# EAGLE board SOTB_LWC (EAGLE 9.6.2)
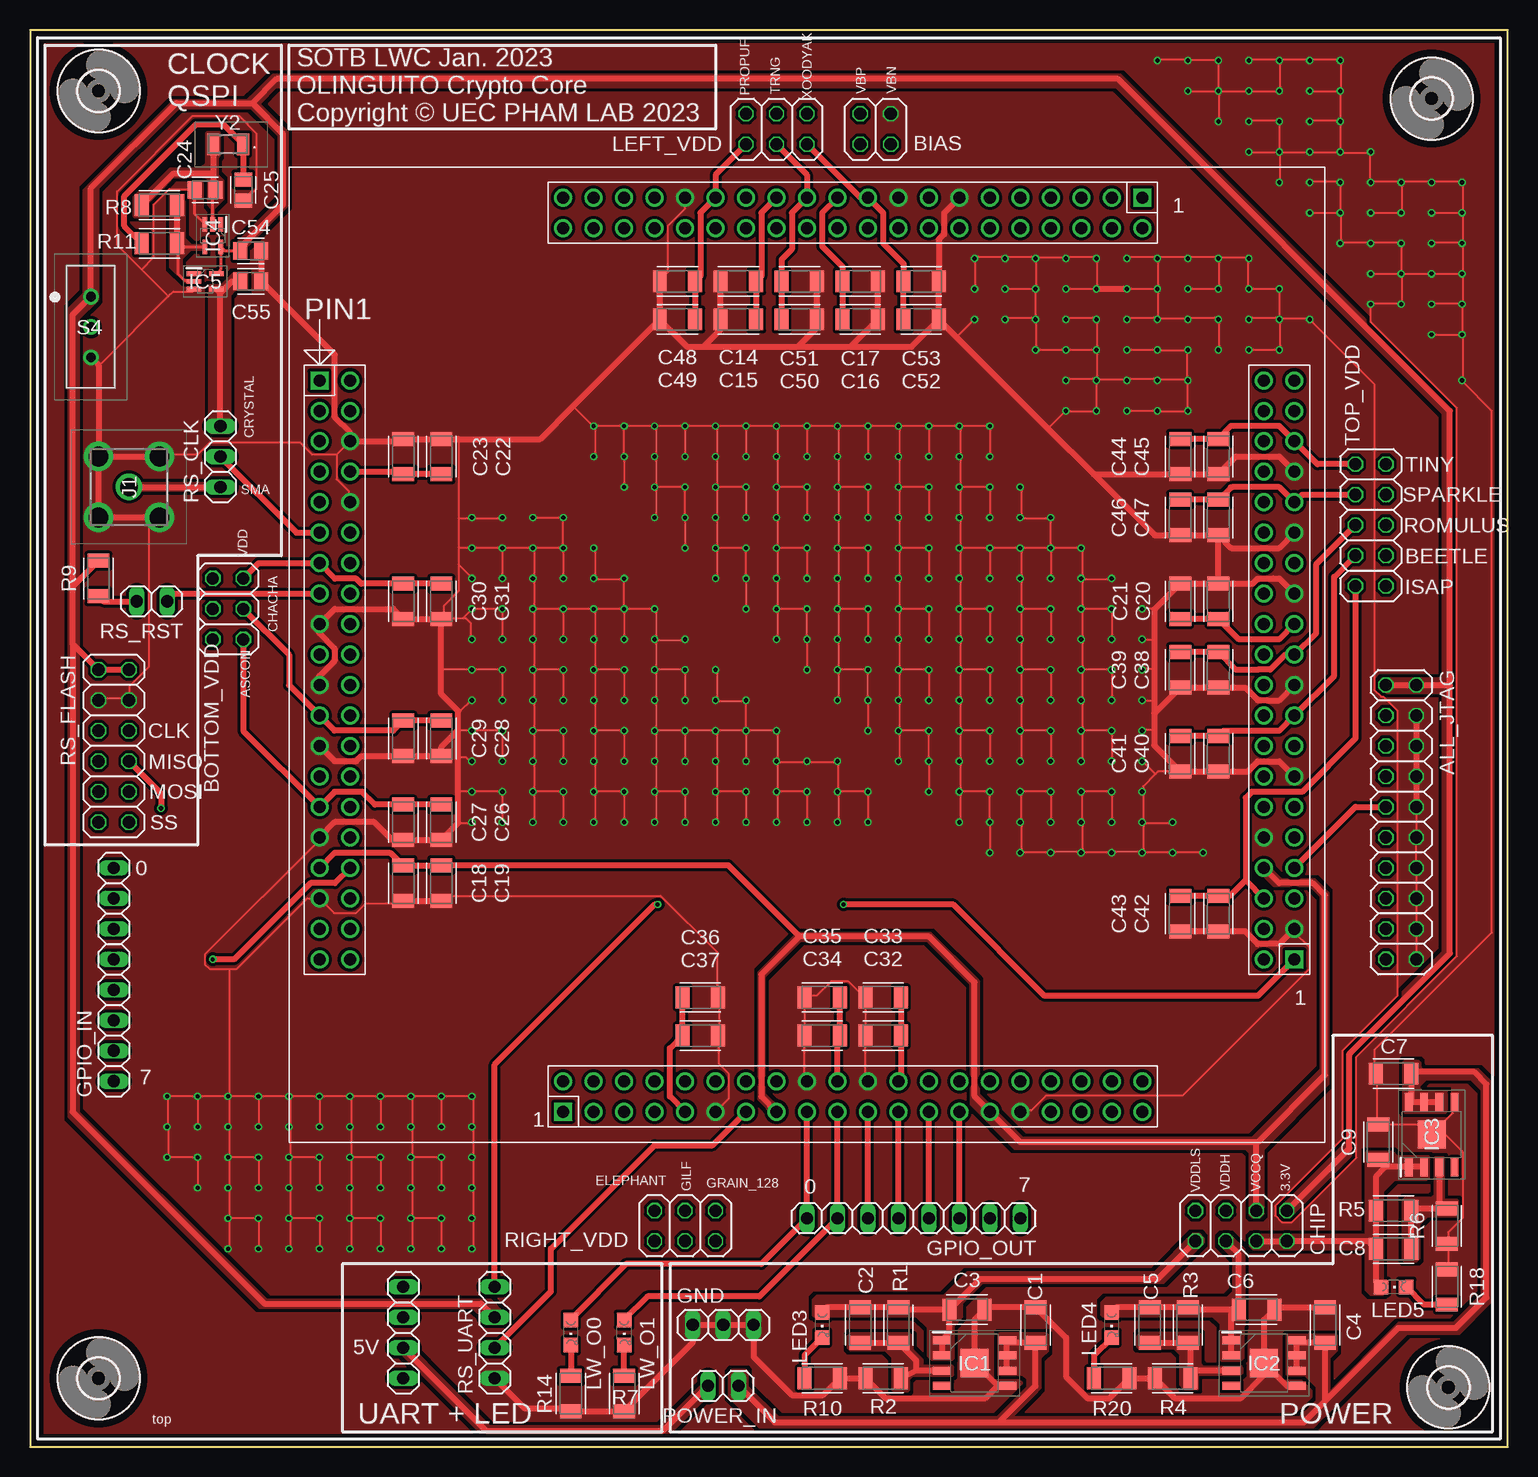
[diagram p1: board, top side]
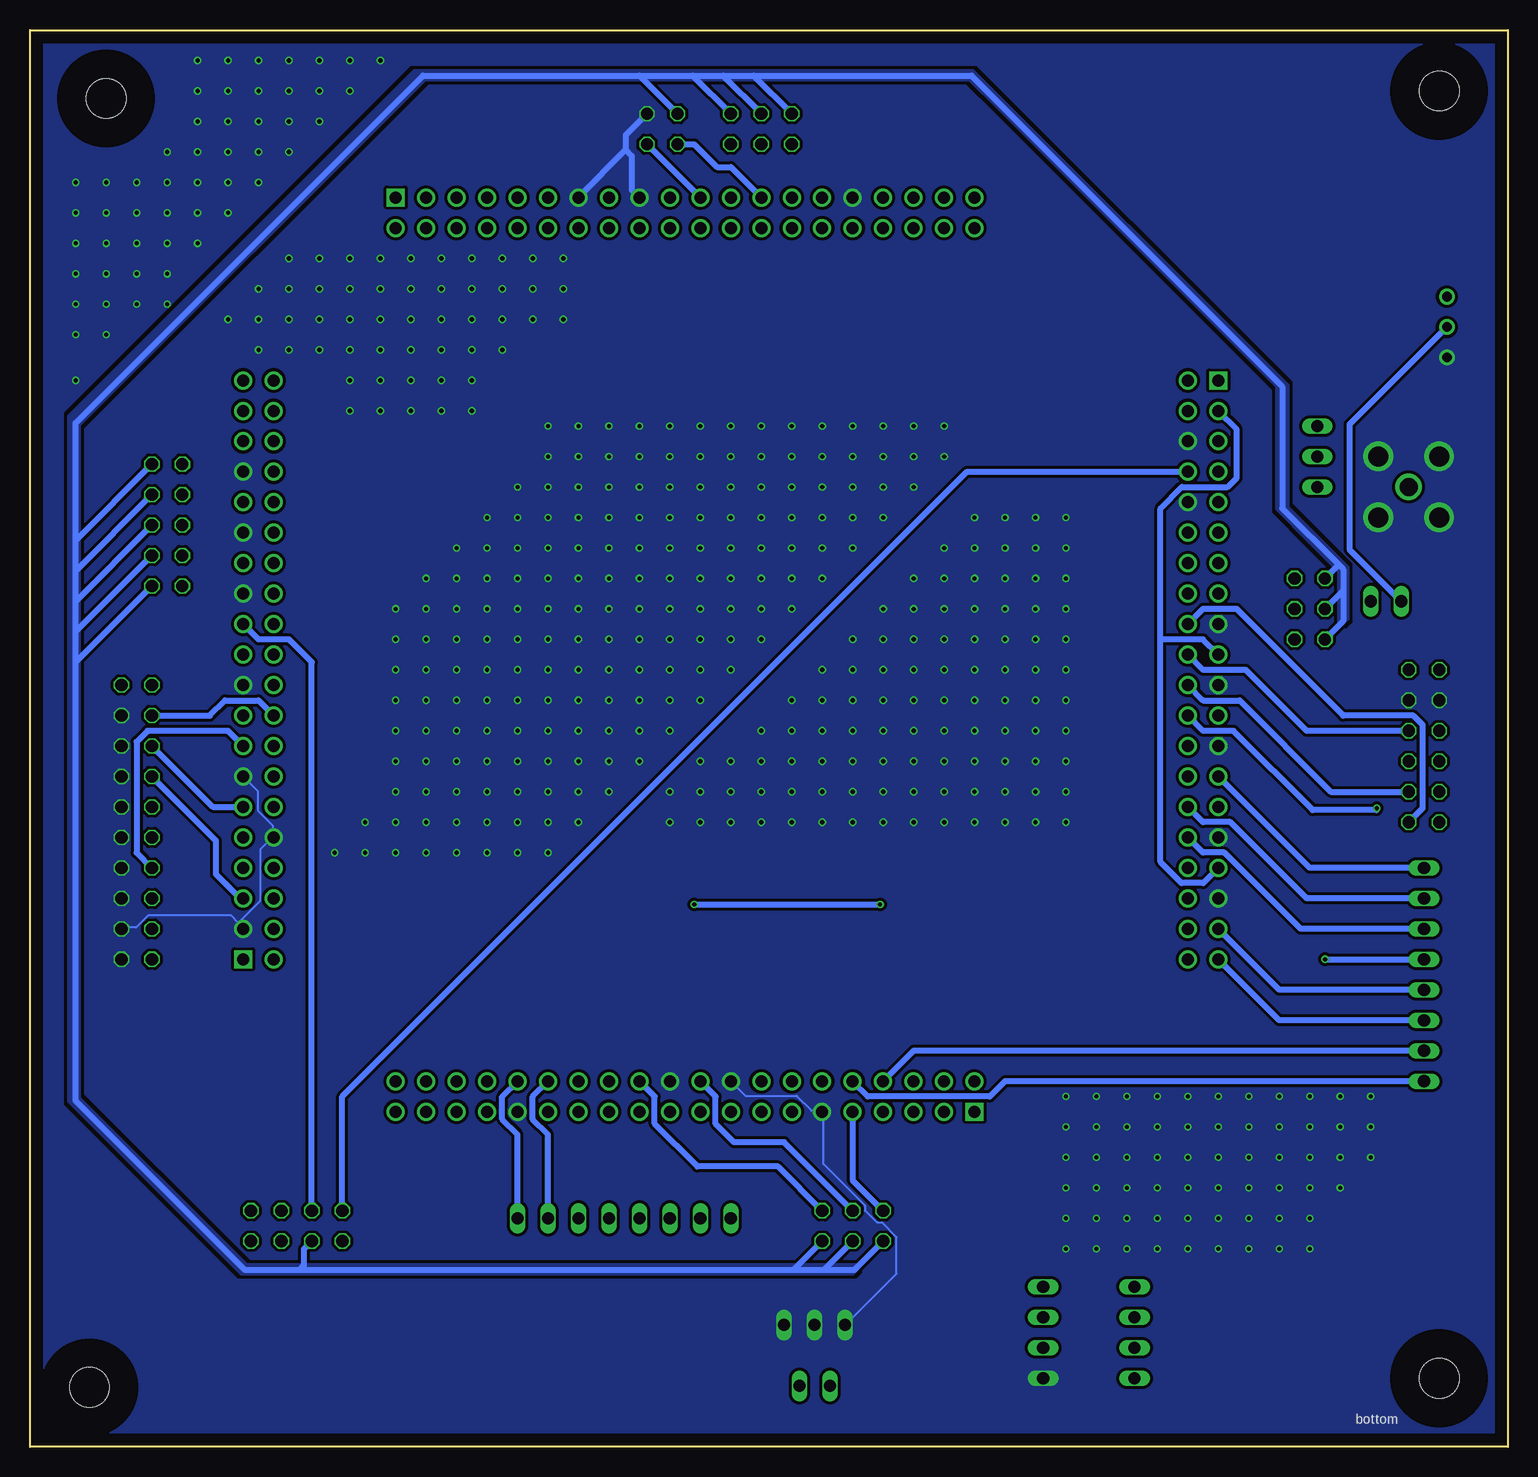
[diagram p2: board, bottom side, seen from below]

Size 123.19 x 118.11 mm. Coordinates in mm from the lower left corner, seen from the top.
Outline: 0,0 123.19,0 123.19,118.11 0,118.11 0,0
Copper layers (1*16): Top 0.035mm / dielectric 1.5mm / Bottom 0.035mm
Design rules "default *": minimum track width 6mil, minimum drill 0.35mm, track to track 10mil, track to pad 10mil, pad to pad 6mil, via to via 10mil, smd to smd 10mil, copper to edge 40mil, drill to drill 6mil, minimum pad ring 0.13mm, minimum via ring 0.13mm, stop-mask expansion 4mil, vias tented up to drill 0mil, thermal gap 10mil

## Footprints (pad centres in the part's own frame; a part is rotated, then mirrored left to right if it is on the bottom)
2X10 = drill 1.016 octagon: 1 -11.43,-1.27; 2 -11.43,1.27; 3 -8.89,-1.27; 4 -8.89,1.27; 5 -6.35,-1.27; 6 -6.35,1.27; 7 -3.81,-1.27; 8 -3.81,1.27; 9 -1.27,-1.27; 10 -1.27,1.27; 11 1.27,-1.27; 12 1.27,1.27; 13 3.81,-1.27; 14 3.81,1.27; 15 6.35,-1.27; 16 6.35,1.27; 17 8.89,-1.27; 18 8.89,1.27; 19 11.43,-1.27; 20 11.43,1.27
2X02 = drill 1.016 octagon: 1 -1.27,-1.27; 2 -1.27,1.27; 3 1.27,-1.27; 4 1.27,1.27
2X03 = drill 1.016 octagon: 1 -2.54,-1.27; 2 -2.54,1.27; 3 0,-1.27; 4 0,1.27; 5 2.54,-1.27; 6 2.54,1.27
CAPC3216X135 = smd 1.165 x 1.815: 1 -1.475,0; 2 1.475,0
CAPC2012X110 = smd 1.165 x 1.465: 1 -0.875,0; 2 0.875,0
2X04 = drill 1.016 octagon: 1 -3.81,-1.27; 2 -3.81,1.27; 3 -1.27,-1.27; 4 -1.27,1.27; 5 1.27,-1.27; 6 1.27,1.27; 7 3.81,-1.27; 8 3.81,1.27
1X03 = drill 1.016 long: 1 -2.54,0; 2 0,0; 3 2.54,0
1X08 = drill 1.016 long: 1 -8.89,0; 2 -6.35,0; 3 -3.81,0; 4 -1.27,0; 5 1.27,0; 6 3.81,0; 7 6.35,0; 8 8.89,0
3,3 = hole 3.3: 0,0
SOIC127P600X170-9N = smd 1.525 x 0.65: 1 -2.712,1.905; 2 -2.712,0.635; 3 -2.712,-0.635; 4 -2.712,-1.905; 5 2.712,-1.905; 6 2.712,-0.635; 7 2.712,0.635; 8 2.712,1.905 | smd 2.34 x 2.34: 9 0,0
SOT65P210X110-5N = smd 1.2 x 0.4: 1 -0.95,0.65; 2 -0.95,0; 3 -0.95,-0.65; 4 0.95,-0.65; 5 0.95,0.65
29856004 = drill 1.64 pad 2.46: 1 0,0; 2 5.08,0; 3 5.08,5.08; 4 0,5.08 | drill 1.47 pad 2.205: 5 2.54,2.54
CHIPLED_0805 = smd 1.2 x 1.2: A 0,-1.05; C 0,1.05
1X02 = drill 1.016 long: 1 -1.27,0; 2 1.27,0
RESC3216X70 = smd 1.165 x 1.815: 1 -1.475,0; 2 1.475,0
2X06 = drill 1.016 octagon: 1 -6.35,-1.27; 2 -6.35,1.27; 3 -3.81,-1.27; 4 -3.81,1.27; 5 -1.27,-1.27; 6 -1.27,1.27; 7 1.27,-1.27; 8 1.27,1.27; 9 3.81,-1.27; 10 3.81,1.27; 11 6.35,-1.27; 12 6.35,1.27
1X04 = drill 1.016 long: 1 -3.81,0; 2 -1.27,0; 3 1.27,0; 4 3.81,0
SS12SDP2 = drill 0.8 pad 1.3: 1 0,2.54; 2 0,0; 3 0,-2.54
QFP28-160PIN = drill 1 pad 1.5 square: P$1 -40.64,22.86; P$41 -20.32,-38.1; P$81 40.64,-25.4; P$121 27.94,38.1 | drill 1 pad 1.5: P$2 -38.1,22.86; P$3 -40.64,20.32; P$4 -38.1,20.32; P$5 -40.64,17.78; P$6 -38.1,17.78; P$7 -40.64,15.24; P$8 -38.1,15.24; P$9 -40.64,12.7; P$10 -38.1,12.7; P$11 -40.64,10.16; P$12 -38.1,10.16; P$13 -40.64,7.62; P$14 -38.1,7.62; P$15 -40.64,5.08; P$16 -38.1,5.08; P$17 -40.64,2.54; P$18 -38.1,2.54; P$19 -40.64,0; P$20 -38.1,0; P$21 -40.64,-2.54; P$22 -38.1,-2.54; P$23 -40.64,-5.08; P$24 -38.1,-5.08; P$25 -40.64,-7.62; P$26 -38.1,-7.62; P$27 -40.64,-10.16; P$28 -38.1,-10.16; P$29 -40.64,-12.7; P$30 -38.1,-12.7; P$31 -40.64,-15.24; P$32 -38.1,-15.24; P$33 -40.64,-17.78; P$34 -38.1,-17.78; P$35 -40.64,-20.32; P$36 -38.1,-20.32; P$37 -40.64,-22.86; P$38 -38.1,-22.86; P$39 -40.64,-25.4; P$40 -38.1,-25.4; P$42 -20.32,-35.56; P$43 -17.78,-38.1; P$44 -17.78,-35.56; P$45 -15.24,-38.1; P$46 -15.24,-35.56; P$47 -12.7,-38.1; P$48 -12.7,-35.56; P$49 -10.16,-38.1; P$50 -10.16,-35.56; P$51 -7.62,-38.1; P$52 -7.62,-35.56; P$53 -5.08,-38.1; P$54 -5.08,-35.56; P$55 -2.54,-38.1; P$56 -2.54,-35.56; P$57 0,-38.1; P$58 0,-35.56; P$59 2.54,-38.1; P$60 2.54,-35.56; P$61 5.08,-38.1; P$62 5.08,-35.56; P$63 7.62,-38.1; P$64 7.62,-35.56; P$65 10.16,-38.1; P$66 10.16,-35.56; P$67 12.7,-38.1; P$68 12.7,-35.56; P$69 15.24,-38.1; P$70 15.24,-35.56; P$71 17.78,-38.1; P$72 17.78,-35.56; P$73 20.32,-38.1; P$74 20.32,-35.56; P$75 22.86,-38.1; P$76 22.86,-35.56; P$77 25.4,-38.1; P$78 25.4,-35.56; P$79 27.94,-38.1; P$80 27.94,-35.56; P$82 38.1,-25.4; P$83 40.64,-22.86; P$84 38.1,-22.86; P$85 40.64,-20.32; P$86 38.1,-20.32; P$87 40.64,-17.78; P$88 38.1,-17.78; P$89 40.64,-15.24; P$90 38.1,-15.24; P$91 40.64,-12.7; P$92 38.1,-12.7; P$93 40.64,-10.16; P$94 38.1,-10.16; P$95 40.64,-7.62; P$96 38.1,-7.62; P$97 40.64,-5.08; P$98 38.1,-5.08; P$99 40.64,-2.54; P$100 38.1,-2.54; P$101 40.64,0; P$102 38.1,0; P$103 40.64,2.54; P$104 38.1,2.54; P$105 40.64,5.08; P$106 38.1,5.08; P$107 40.64,7.62; P$108 38.1,7.62; P$109 40.64,10.16; P$110 38.1,10.16; P$111 40.64,12.7; P$112 38.1,12.7; P$113 40.64,15.24; P$114 38.1,15.24; P$115 40.64,17.78; P$116 38.1,17.78; P$117 40.64,20.32; P$118 38.1,20.32; P$119 40.64,22.86; P$120 38.1,22.86; P$122 27.94,35.56; P$123 25.4,38.1; P$124 25.4,35.56; P$125 22.86,38.1; P$126 22.86,35.56; P$127 20.32,38.1; P$128 20.32,35.56; P$129 17.78,38.1; P$130 17.78,35.56; P$131 15.24,38.1; P$132 15.24,35.56; P$133 12.7,38.1; P$134 12.7,35.56; P$135 10.16,38.1; P$136 10.16,35.56; P$137 7.62,38.1; P$138 7.62,35.56; P$139 5.08,38.1; P$140 5.08,35.56; P$141 2.54,38.1; P$142 2.54,35.56; P$143 0,38.1; P$144 0,35.56; P$145 -2.54,38.1; P$146 -2.54,35.56; P$147 -5.08,38.1; P$148 -5.08,35.56; P$149 -7.62,38.1; P$150 -7.62,35.56; P$151 -10.16,38.1; P$152 -10.16,35.56; P$153 -12.7,38.1; P$154 -12.7,35.56; P$155 -15.24,38.1; P$156 -15.24,35.56; P$157 -17.78,38.1; P$158 -17.78,35.56; P$159 -20.32,38.1; P$160 -20.32,35.56
2X05 = drill 1.016 octagon: 1 -5.08,-1.27; 2 -5.08,1.27; 3 -2.54,-1.27; 4 -2.54,1.27; 5 0,-1.27; 6 0,1.27; 7 2.54,-1.27; 8 2.54,1.27; 9 5.08,-1.27; 10 5.08,1.27
Q13FC1350000400 = smd 1 x 1.8: 1 -1.25,0; 2 1.25,0

## Placement (x,y rotation side)
ALL_JTAG  [2X10]  114.3,52.07 270 top
BIAS  [2X02]  70.48,109.86 0 top
BOTTOM_VDD  PINHD-2X3  [2X03]  16.51,69.85 90 top
C1  10uF  [CAPC3216X135]  83.82,10.16 90 top
C2  4.7nF  [CAPC3216X135]  69.22,10.16 270 top
C3  10uF  [CAPC3216X135]  78.1,11.43 0 top
C4  10uF  [CAPC3216X135]  107.95,10.16 90 top
C5  3.3nF  [CAPC3216X135]  93.34,10.16 270 top
C6  10uF  [CAPC3216X135]  102.23,11.43 0 top
C7  10uF  [CAPC3216X135]  113.66,31.12 180 top
C8  2.7nF  [CAPC3216X135]  113.66,16.51 0 top
C9  10uF  [CAPC3216X135]  112.39,25.4 90 top
C14  10uF  [CAPC3216X135]  59.05,97.16 180 top
C15  0.1uF  [CAPC3216X135]  59.05,93.98 180 top
C16  10uF  [CAPC3216X135]  69.22,93.98 0 top
C17  0.1uF  [CAPC3216X135]  69.22,97.16 0 top
C18  10uF  [CAPC3216X135]  31.11,46.99 270 top
C19  0.1uF  [CAPC3216X135]  34.29,46.99 270 top
C20  10uF  [CAPC3216X135]  99.06,70.49 90 top
C21  0.1uF  [CAPC3216X135]  95.88,70.49 90 top
C22  10uF  [CAPC3216X135]  34.29,82.55 90 top
C23  0.1uF  [CAPC3216X135]  31.11,82.55 90 top
C24  25pF  [CAPC2012X110]  14.6,104.78 180 top
C25  25pF  [CAPC2012X110]  17.78,104.78 270 top
C26  10uF  [CAPC3216X135]  34.29,52.07 270 top
C27  0.1uF  [CAPC3216X135]  31.11,52.07 270 top
C28  10uF  [CAPC3216X135]  34.29,59.06 270 top
C29  0.1uF  [CAPC3216X135]  31.11,59.06 270 top
C30  10uF  [CAPC3216X135]  31.11,70.49 270 top
C31  0.1uF  [CAPC3216X135]  34.29,70.49 270 top
C32  10uF  [CAPC3216X135]  71.12,34.29 180 top
C33  0.1uF  [CAPC3216X135]  71.12,37.47 180 top
C34  10uF  [CAPC3216X135]  66.04,34.29 180 top
C35  0.1uF  [CAPC3216X135]  66.04,37.47 180 top
C36  10uF  [CAPC3216X135]  55.88,37.47 0 top
C37  0.1uF  [CAPC3216X135]  55.88,34.29 0 top
C38  10uF  [CAPC3216X135]  99.06,64.77 270 top
C39  0.1uF  [CAPC3216X135]  95.88,64.77 270 top
C40  10uF  [CAPC3216X135]  99.06,57.79 270 top
C41  0.1uF  [CAPC3216X135]  95.88,57.79 270 top
C42  10uF  [CAPC3216X135]  99.06,44.45 270 top
C43  0.1uF  [CAPC3216X135]  95.88,44.45 270 top
C44  10uF  [CAPC3216X135]  95.88,82.55 270 top
C45  0.1uF  [CAPC3216X135]  99.06,82.55 270 top
C46  10uF  [CAPC3216X135]  95.88,77.47 270 top
C47  0.1uF  [CAPC3216X135]  99.06,77.47 270 top
C48  10uF  [CAPC3216X135]  53.97,97.16 180 top
C49  0.1uF  [CAPC3216X135]  53.97,93.98 180 top
C50  10uF  [CAPC3216X135]  64.13,93.98 0 top
C51  0.1uF  [CAPC3216X135]  64.13,97.16 0 top
C52  10uF  [CAPC3216X135]  74.3,93.98 0 top
C53  0.1uF  [CAPC3216X135]  74.3,97.16 0 top
C54  100pF  [CAPC2012X110]  18.41,99.7 0 top
C55  50pF  [CAPC2012X110]  18.41,97.16 0 top
CHIP  PINHD-2X4  [2X04]  100.97,18.42 180 top
GND  [1X03]  57.78,10.16 0 top
GPIO_IN  [1X08]  6.98,39.37 90 top
GPIO_OUT  [1X08]  73.66,19.05 180 top
H1  MOUNT-HOLE3.3  [3,3]  5.71,5.72 0 top
H2  MOUNT-HOLE3.3  [3,3]  118.24,4.95 0 top
H3  MOUNT-HOLE3.3  [3,3]  5.71,113.03 0 top
H4  MOUNT-HOLE3.3  [3,3]  116.84,112.4 0 top
IC1  LP38511MR-ADJ_NOPB  [SOIC127P600X170-9N]  78.74,6.99 0 top
IC2  LP38511MR-ADJ_NOPB  [SOIC127P600X170-9N]  102.87,6.99 0 top
IC3  LP38511MR-ADJ_NOPB  [SOIC127P600X170-9N]  116.84,26.04 90 top
IC4  SN74LVC1GU04DCKR  [SOT65P210X110-5N]  15.24,100.97 270 top
IC5  SN74LVC1G14DCKR  [SOT65P210X110-5N]  14.6,97.16 0 top
J1  2985-6004  [29856004]  5.71,82.55 270 top
LED3  [CHIPLED_0805]  66.04,10.16 180 top
LED4  [CHIPLED_0805]  90.17,10.16 180 top
LED5  [CHIPLED_0805]  113.66,13.34 270 top
LEFT_VDD  PINHD-2X3  [2X03]  62.23,109.86 0 top
LW_O0  [CHIPLED_0805]  45.08,9.53 180 top
LW_O1  [CHIPLED_0805]  49.53,9.53 180 top
POWER_IN  [1X02]  57.78,5.08 180 top
R1  1.07k  [RESC3216X70]  72.39,10.16 270 top
R2  1.78k  [RESC3216X70]  71.12,5.72 0 top
R3  1.4k  [RESC3216X70]  96.52,10.16 270 top
R4  1k  [RESC3216X70]  95.25,5.72 0 top
R5  2k  [RESC3216X70]  113.66,19.69 0 top
R6  357  [RESC3216X70]  118.11,18.42 90 top
R7  1k  [RESC3216X70]  49.53,4.45 90 top
R8  2.2M  [RESC3216X70]  10.79,103.51 0 top
R9  10k  [RESC3216X70]  5.71,72.39 90 top
R10  100  [RESC3216X70]  66.04,5.72 180 top
R11  1k  [RESC3216X70]  10.79,100.33 0 top
R14  1k  [RESC3216X70]  45.08,4.45 90 top
R18  1k  [RESC3216X70]  118.11,13.34 270 top
R20  330  [RESC3216X70]  90.17,5.72 180 top
RIGHT_VDD  PINHD-2X3  [2X03]  54.61,18.42 180 top
RS_CLK  [1X03]  15.87,82.55 90 top
RS_FLASH  PINHD-2X6  [2X06]  6.98,58.42 270 top
RS_RST  [1X02]  10.16,70.49 180 top
RS_UART  PINHD-1X4  [1X04]  38.73,9.53 90 top
S4  SS12SDP2  [SS12SDP2]  5.08,93.34 0 top
SOCKET  [QFP28-160PIN]  64.77,66.04 0 top
TOP_VDD  [2X05]  111.76,76.84 270 top
USB-UART_4  PINHD-1X4  [1X04]  31.11,9.53 90 top
Y2  Q13FC1350000400  [Q13FC1350000400]  16.51,108.59 180 top

## Tracks (layer width: path | path; a pad name or v marks a point on that pad's centre or on a via)
CLOCK_OSC
  Top 0.508: RS_CLK.3 15.87,96.19 | 15.87,96.19 IC5.4 | 15.87,96.19 16.84,97.16 C55.1
  pour Top (no thermals): 14.88,96.75 14.88,84.71 15.11,84.48 16.61,84.48 16.69,84.56 16.71,84.58 16.71,87 16.71,96.01 17.12,96.42 18.08,96.42 18.14,96.47 18.14,97.89 18.11,97.92 17.02,97.92 15.98,96.88 15.57,96.88 15.01,96.88
GND  (via drill 0.35)
  Top 0.152: SOCKET.P$51 58.27,29.06 58.27,31.09 57.45,31.9 57.45,34.14 C37.2 57.45,34.34 57.45,37.39 C36.2 57.25,37.59 57.25,41.25 52.58,45.92 34.9,45.92 34.49,45.52 C19.2 | SOCKET.P$58 64.57,30.68 64.57,34.14 C34.2 64.57,34.34 64.57,37.39 C35.2 64.57,37.59 65.58,37.59 66.8,38.81 68.22,38.81 69.44,37.59 C33.2 69.65,37.39 69.65,34.34 C32.2 69.65,34.14 69.65,30.68 SOCKET.P$62 | R18.1 118.21,14.83 118.21,16.87 R6.1 118.21,17.07 118.21,17.88 119.43,19.1 119.43,24.59 117.4,26.62 | 117.4,26.62 116.99,26.21 IC3.9 | 117.4,26.62 118.62,27.84 118.62,28.65 IC3.5 | 117.4,26.62 IC3.9 | IC3.9 116.79,26.21 116.18,26.82 112.52,26.82 C9.2 112.32,27.03 112.32,31.09 C7.2 112.12,31.29 112.12,33.12 121.87,42.88 121.87,86.36 119.43,88.8 v119.38,88.9 119.43,89 119.43,92.66 v119.38,92.71 | RS_FLASH.3 5.84,62.38 8.08,62.38 RS_FLASH.4 8.28,62.38 8.28,63.4 9.91,65.02 9.91,77.42 J1.3 | 11.53,95.91 5.84,90.22 5.71,90.17 | 11.53,95.91 11.94,96.32 13.56,96.32 IC5.3 | 11.53,95.91 9.3,98.15 | 9.3,98.15 7.26,100.18 7.26,104.65 13.56,110.95 17.42,110.95 18.85,109.53 18.85,104.85 18.64,104.65 18.44,104.65 17.83,104.04 C25.2 | 9.3,98.15 10.31,99.16 10.31,103.56 11.61,104.85 13.56,104.85 C24.2 | ALL_JTAG.20 ALL_JTAG.18 ALL_JTAG.16 ALL_JTAG.14 ALL_JTAG.12 ALL_JTAG.10 | SOCKET.P$71 82.65,28.04 83.46,28.04 84.68,29.26 96.06,29.26 106.63,39.83 106.63,41.66 105.41,42.88 SOCKET.P$83 | C18.2 31.04,45.31 27.99,45.31 27.18,44.5 25.35,44.5 SOCKET.P$35 23.11,45.72 17.22,39.83 16.61,39.83 | 16.61,39.83 14.99,39.83 14.58,40.23 14.58,41.05 24.13,50.6 SOCKET.P$31 | 25.55,82.7 25.55,80.67 26.57,79.65 26.57,78.84 SOCKET.P$10
  Top 0.152: SOCKET.P$6 25.55,82.7 | SOCKET.P$151 54.61,103.23 53.19,101.8 53.19,97.94 52.58,97.33 C48.2 | 34.49,69.09 34.49,70.1 35.71,71.32 35.71,73.56 | 35.71,84.03 35.71,77.42 | 35.71,77.42 35.71,74.98 | 35.71,74.98 35.71,73.56 | 25.55,82.7 23.52,82.7 22.5,83.72 14.99,83.72 13.97,82.7 10.92,82.7 J1.4 | v93.98,115.57 94.03,115.62 96.47,115.62 v96.52,115.57 96.67,115.62 98.91,115.62 v99.06,115.57 99.11,115.42 99.11,113.18 v99.06,113.03 | 99.11,112.98 99.11,110.54 v99.06,110.49 | v96.52,113.03 96.67,112.98 98.91,112.98 v99.06,113.03 | v101.6,115.57 101.75,115.62 103.99,115.62 v104.14,115.57 | v104.14,115.57 104.19,115.42 104.19,113.18 v104.14,113.03 103.99,112.98 101.75,112.98 v101.6,113.03 101.55,112.98 99.11,112.98 | v106.68,113.03 106.83,112.98 109.07,112.98 v109.22,113.03 | v109.22,113.03 109.27,113.18 109.27,115.42 v109.22,115.57 109.07,115.62 106.83,115.62 v106.68,115.57 106.63,115.62 104.19,115.62 v104.14,115.57 | 99.11,112.98 v99.06,113.03 | v106.68,105.41 106.83,105.46 109.07,105.46 v109.22,105.41 109.27,105.26 109.27,103.02 v109.22,102.87 | v106.68,102.87 106.83,102.82 109.07,102.82 v109.22,102.87 | 109.27,100.38 109.27,102.82 v109.22,102.87 | 111.79,95.26 111.91,95.3 114.15,95.3 v114.3,95.25 114.35,95.3 114.35,97.74 | 111.79,95.26 v111.76,95.25 | v111.76,97.79 111.91,97.74 114.15,97.74 v114.3,97.79 | v114.3,97.79 114.35,97.94 114.35,100.18 v114.3,100.33 114.15,100.38 111.91,100.38 v111.76,100.33 111.71,100.38 109.27,100.38 | 109.27,100.38 v109.22,100.33 | v101.6,110.49 101.75,110.54 103.99,110.54 v104.14,110.49 104.19,110.34 104.19,108.1 v104.14,107.95
  Top 0.152: 104.19,107.9 104.19,105.46 v104.14,105.41 | v101.6,107.95 101.75,107.9 103.99,107.9 v104.14,107.95 | v106.68,110.49 106.83,110.54 109.07,110.54 v109.22,110.49 | v109.22,107.95 109.07,107.9 106.83,107.9 v106.68,107.95 106.63,107.9 104.19,107.9 | 111.71,107.9 109.27,107.9 v109.22,107.95 | v109.22,110.49 109.27,110.34 109.27,108.1 v109.22,107.95 | 104.19,107.9 v104.14,107.95 | v116.84,95.25 116.99,95.3 119.23,95.3 v119.38,95.25 | v116.84,92.71 116.99,92.66 119.23,92.66 v119.38,92.71 | v119.38,95.25 119.43,95.1 119.43,92.86 v119.38,92.71 | v111.76,102.87 111.91,102.82 114.15,102.82 v114.3,102.87 114.35,103.02 114.35,105.26 v114.3,105.41 | v114.3,105.41 114.15,105.46 111.91,105.46 v111.76,105.41 111.71,105.46 111.71,107.9 | v119.38,97.79 119.23,97.74 116.99,97.74 v116.84,97.79 116.79,97.74 114.35,97.74 | v116.84,100.33 116.99,100.38 119.23,100.38 v119.38,100.33 | v119.38,97.79 119.43,97.94 119.43,100.18 v119.38,100.33 | v116.84,102.87 116.99,102.82 119.23,102.82 v119.38,102.87 | v119.38,102.87 119.43,103.02 119.43,105.26 v119.38,105.41 119.23,105.46 116.99,105.46 v116.84,105.41 116.79,105.46 114.35,105.46 v114.3,105.41 | v119.38,100.33 119.43,100.38 119.43,102.82 v119.38,102.87 | v119.38,95.25 119.43,95.3 119.43,97.74 v119.38,97.79 | 111.71,107.9 v111.76,107.95 | 114.35,97.74 v114.3,97.79 | v109.22,113.03 109.27,112.98 109.27,110.54 v109.22,110.49 | v69.85,52.07 v69.85,54.61 69.85,54.66 67.41,54.66 | v67.31,52.07 67.41,52.22 67.41,54.46 v67.31,54.61 67.41,54.66 | 67.41,54.66 67.41,57.1 v67.31,57.15 67.21,57.1 64.77,57.1 | v64.77,52.07 v64.77,54.61 64.77,54.66 62.33,54.66
  Top 0.152: v62.23,52.07 62.33,52.22 62.33,54.46 v62.23,54.61 62.33,54.66 | 62.33,57.1 64.77,57.1 | 62.33,57.1 62.33,54.66 | 62.33,57.1 v62.23,57.15 62.33,57.3 62.33,59.54 v62.23,59.69 62.13,59.74 59.69,59.74 | 64.77,57.1 v64.77,57.15 | v57.15,64.77 57.25,64.62 57.25,62.38 v57.15,62.23 57.25,62.18 59.69,62.18 | v59.69,52.07 v59.69,54.61 59.69,54.66 57.25,54.66 | v57.15,52.07 57.25,52.22 57.25,54.46 v57.15,54.61 57.25,54.66 | v59.69,57.15 v59.69,59.69 59.69,59.74 | v57.15,59.69 57.25,59.54 57.25,57.3 v57.15,57.15 57.25,57.1 57.25,54.66 | 59.69,59.74 57.25,59.74 v57.15,59.69 | 59.69,59.74 59.69,62.18 | 59.69,62.18 v59.69,62.23 | v54.61,52.07 v54.61,54.61 54.61,54.66 52.17,54.66 | v52.07,52.07 52.17,52.22 52.17,54.46 v52.07,54.61 52.17,54.66 | v54.61,57.15 v54.61,59.69 54.61,59.74 | 52.17,59.74 54.61,59.74 | 52.17,54.66 52.17,57.1 v52.07,57.15 52.17,57.3 52.17,59.54 v52.07,59.69 52.17,59.74 | v49.53,52.07 v49.53,54.61 49.53,54.66 47.09,54.66 | v46.99,52.07 47.09,52.22 47.09,54.46 v46.99,54.61 47.09,54.66 | v49.53,57.15 v49.53,59.69 49.53,59.74 47.09,59.74 | 47.09,54.66 47.09,57.1 v46.99,57.15 47.09,57.3 47.09,59.54 v46.99,59.69 47.09,59.74 | v54.61,62.23 v54.61,64.77 54.61,64.82 52.17,64.82 | 52.17,67.26 54.61,67.26 v54.61,67.31 | 52.17,67.26 52.17,64.82 | 52.17,64.82 v52.07,64.77 52.17,64.62 52.17,62.38 v52.07,62.23 52.17,62.18 52.17,59.74 | 52.17,67.26 v52.07,67.31 52.17,67.46 52.17,69.7 v52.07,69.85 51.97,69.9 49.53,69.9 | v46.99,74.93 47.09,74.78 47.09,72.54 v46.99,72.39 47.09,72.34 49.53,72.34 | v49.53,62.23 v49.53,64.77 49.53,64.82 47.09,64.82 | v49.53,67.31 v49.53,69.85 49.53,69.9
  Top 0.152: v46.99,69.85 47.09,69.7 47.09,67.46 v46.99,67.31 47.09,67.26 47.09,64.82 | 49.53,69.9 47.09,69.9 v46.99,69.85 | 47.09,64.82 v46.99,64.77 47.09,64.62 47.09,62.38 v46.99,62.23 47.09,62.18 47.09,59.74 | 49.53,69.9 49.53,72.34 | 49.53,72.34 v49.53,72.39 | 54.61,59.74 57.05,59.74 v57.15,59.69 | v90.17,57.15 v90.17,59.69 90.17,59.74 87.73,59.74 | v87.63,57.15 87.73,57.3 87.73,59.54 v87.63,59.69 87.73,59.74 | v90.17,62.23 v90.17,64.77 90.17,64.82 87.73,64.82 | 87.73,59.74 87.73,62.18 v87.63,62.23 87.73,62.38 87.73,64.62 v87.63,64.77 87.73,64.82 | v85.09,57.15 v85.09,59.69 85.09,59.74 82.65,59.74 | v82.55,57.15 82.65,57.3 82.65,59.54 v82.55,59.69 82.65,59.74 | v85.09,62.23 v85.09,64.77 85.09,64.82 82.65,64.82 | 82.65,59.74 82.65,62.18 v82.55,62.23 82.65,62.38 82.65,64.62 v82.55,64.77 82.65,64.82 | v90.17,67.31 v90.17,69.85 90.17,69.9 87.73,69.9 | 87.73,72.34 90.17,72.34 v90.17,72.39 | 87.73,72.34 87.73,69.9 | 87.73,69.9 v87.63,69.85 87.73,69.7 87.73,67.46 v87.63,67.31 87.73,67.26 87.73,64.82 | 87.73,72.34 v87.63,72.39 87.73,72.54 87.73,74.78 v87.63,74.93 87.53,74.98 85.09,74.98 | v82.55,80.01 82.65,79.86 82.65,77.62 v82.55,77.47 82.65,77.42 85.09,77.42 | v85.09,67.31 v85.09,69.85 85.09,69.9 82.65,69.9 | v85.09,72.39 v85.09,74.93 85.09,74.98 | v82.55,74.93 82.65,74.78 82.65,72.54 v82.55,72.39 82.65,72.34 82.65,69.9 | 85.09,74.98 82.65,74.98 v82.55,74.93 | 82.65,69.9 v82.55,69.85 82.65,69.7 82.65,67.46 v82.55,67.31 82.65,67.26 82.65,64.82 | 85.09,74.98 85.09,77.42 | 85.09,77.42 v85.09,77.47 | v80.01,49.53 v80.01,52.07 v80.01,54.61 80.01,54.66 77.57,54.66 | v77.47,52.07 77.57,52.22 77.57,54.46 v77.47,54.61 77.57,54.66
  Top 0.152: v80.01,57.15 v80.01,59.69 80.01,59.74 77.57,59.74 | 77.57,54.66 77.57,57.1 v77.47,57.15 77.57,57.3 77.57,59.54 v77.47,59.69 77.57,59.74 | v80.01,62.23 v80.01,64.77 80.01,64.82 77.57,64.82 | v80.01,67.31 v80.01,69.85 80.01,69.9 77.57,69.9 | 77.57,64.82 77.57,67.26 v77.47,67.31 77.57,67.46 77.57,69.7 v77.47,69.85 77.57,69.9 | 77.57,64.82 v77.47,64.77 77.57,64.62 77.57,62.38 v77.47,62.23 77.57,62.18 77.57,59.74 | v80.01,72.39 v80.01,74.93 80.01,74.98 | 77.57,74.98 80.01,74.98 | v80.01,77.47 v80.01,80.01 80.01,80.06 77.57,80.06 | 77.57,74.98 77.57,77.42 v77.47,77.47 77.57,77.62 77.57,79.86 v77.47,80.01 77.57,80.06 | 77.57,74.98 v77.47,74.93 77.57,74.78 77.57,72.54 v77.47,72.39 77.57,72.34 77.57,69.9 | 80.01,74.98 82.45,74.98 v82.55,74.93 | v34.29,16.51 v34.29,19.05 34.29,19.1 31.85,19.1 | v31.75,16.51 31.85,16.66 31.85,18.9 v31.75,19.05 31.85,19.1 | v34.29,21.59 v34.29,24.13 34.29,24.18 31.85,24.18 | 31.85,19.1 31.85,21.54 v31.75,21.59 31.85,21.74 31.85,23.98 v31.75,24.13 31.85,24.18 | v36.83,16.51 36.93,16.66 36.93,18.9 v36.83,19.05 36.93,19.1 36.93,21.54 v36.83,21.59 36.93,21.74 36.93,23.98 v36.83,24.13 36.93,24.18 36.93,26.62 v36.83,26.67 36.93,26.82 36.93,29.06 v36.83,29.21 36.73,29.26 34.29,29.26 | v34.29,26.67 v34.29,29.21 34.29,29.26 | v31.75,29.21 31.85,29.06 31.85,26.82 v31.75,26.67 31.85,26.62 31.85,24.18 | 34.29,29.26 31.85,29.26 v31.75,29.21 | v29.21,16.51 v29.21,19.05 29.21,19.1 26.77,19.1 | v26.67,16.51 26.77,16.66 26.77,18.9 v26.67,19.05 26.77,19.1 | v29.21,21.59 v29.21,24.13 29.21,24.18 26.77,24.18 | 26.77,19.1 26.77,21.54 v26.67,21.59 26.77,21.74 26.77,23.98 v26.67,24.13 26.77,24.18
  Top 0.152: v24.13,16.51 v24.13,19.05 24.13,19.1 21.69,19.1 | v21.59,16.51 21.69,16.66 21.69,18.9 v21.59,19.05 21.69,19.1 | v24.13,21.59 v24.13,24.13 24.13,24.18 21.69,24.18 | 21.69,19.1 21.69,21.54 v21.59,21.59 21.69,21.74 21.69,23.98 v21.59,24.13 21.69,24.18 | v19.05,16.51 v19.05,19.05 19.05,19.1 16.61,19.1 | v16.51,16.51 16.61,16.66 16.61,18.9 v16.51,19.05 16.61,19.1 | v19.05,21.59 v19.05,24.13 19.05,24.18 16.61,24.18 | 16.61,19.1 16.61,21.54 v16.51,21.59 16.61,21.74 16.61,23.98 v16.51,24.13 16.61,24.18 | v29.21,26.67 v29.21,29.21 29.21,29.26 | v26.67,29.21 26.77,29.06 26.77,26.82 v26.67,26.67 26.77,26.62 26.77,24.18 | 29.21,29.26 26.77,29.26 v26.67,29.21 | v24.13,26.67 v24.13,29.21 24.13,29.26 | v21.59,29.21 21.69,29.06 21.69,26.82 v21.59,26.67 21.69,26.62 21.69,24.18 | 24.13,29.26 21.69,29.26 v21.59,29.21 | v19.05,26.67 v19.05,29.21 19.05,29.26 | v16.51,29.21 16.61,29.06 16.61,26.82 v16.51,26.67 16.61,26.62 16.61,24.18 | 16.61,29.26 19.05,29.26 | v13.97,26.67 v13.97,29.21 13.97,29.26 | v13.97,21.59 v13.97,24.13 13.97,24.18 11.53,24.18 | 11.53,24.18 11.53,26.62 v11.43,26.67 11.53,26.82 11.53,29.06 v11.43,29.21 11.53,29.26 13.97,29.26 | 11.53,24.18 v11.43,24.13 | 13.97,29.26 16.41,29.26 v16.51,29.21 | 19.05,29.26 21.49,29.26 v21.59,29.21 | 24.13,29.26 26.57,29.26 v26.67,29.21 | 29.21,29.26 31.65,29.26 v31.75,29.21 | v74.93,54.61 v74.93,57.15 v74.93,59.69 74.93,59.74 72.49,59.74 | v72.39,57.15 72.49,57.3 72.49,59.54 v72.39,59.69 72.49,59.74 | v74.93,62.23 v74.93,64.77 74.93,64.82 72.49,64.82 | 72.49,59.74 72.49,62.18 v72.39,62.23 72.49,62.38 72.49,64.62 v72.39,64.77 72.49,64.82
  Top 0.152: v74.93,67.31 v74.93,69.85 74.93,69.9 72.49,69.9 | v74.93,72.39 v74.93,74.93 74.93,74.98 72.49,74.98 | 72.49,69.9 72.49,72.34 v72.39,72.39 72.49,72.54 72.49,74.78 v72.39,74.93 72.49,74.98 | 72.49,69.9 v72.39,69.85 72.49,69.7 72.49,67.46 v72.39,67.31 72.49,67.26 72.49,64.82 | v80.01,82.55 v80.01,85.09 80.01,85.14 77.57,85.14 v77.47,85.09 | v77.47,85.09 77.57,84.94 77.57,82.7 v77.47,82.55 77.57,82.5 77.57,80.06 | v74.93,77.47 v74.93,80.01 74.93,80.06 72.49,80.06 | v74.93,82.55 v74.93,85.09 74.93,85.14 | v72.39,85.09 72.49,84.94 72.49,82.7 v72.39,82.55 72.49,82.5 72.49,80.06 | 74.93,85.14 72.49,85.14 v72.39,85.09 | 72.49,80.06 v72.39,80.01 72.49,79.86 72.49,77.62 v72.39,77.47 72.49,77.42 72.49,74.98 | 74.93,85.14 77.37,85.14 v77.47,85.09 | v64.77,64.77 v64.77,67.31 v64.77,69.85 64.77,69.9 62.33,69.9 | v62.23,67.31 62.33,67.46 62.33,69.7 v62.23,69.85 62.33,69.9 | v64.77,72.39 v64.77,74.93 64.77,74.98 62.33,74.98 | 62.33,69.9 62.33,72.34 v62.23,72.39 62.33,72.54 62.33,74.78 v62.23,74.93 62.33,74.98 | v69.85,59.69 v69.85,62.23 v69.85,64.77 69.85,64.82 67.41,64.82 | v67.31,62.23 67.41,62.38 67.41,64.62 v67.31,64.77 67.41,64.82 | v69.85,67.31 v69.85,69.85 69.85,69.9 67.41,69.9 | 67.41,64.82 67.41,67.26 v67.31,67.31 67.41,67.46 67.41,69.7 v67.31,69.85 67.41,69.9 | v69.85,72.39 v69.85,74.93 69.85,74.98 67.41,74.98 | v69.85,77.47 v69.85,80.01 69.85,80.06 67.41,80.06 | 67.41,74.98 67.41,77.42 v67.31,77.47 67.41,77.62 67.41,79.86 v67.31,80.01 67.41,80.06 | 67.41,74.98 v67.31,74.93 67.41,74.78 67.41,72.54 v67.31,72.39 67.41,72.34 67.41,69.9 | v69.85,82.55 v69.85,85.09 69.85,85.14
  Top 0.152: v67.31,85.09 67.41,84.94 67.41,82.7 v67.31,82.55 67.41,82.5 67.41,80.06 | 69.85,85.14 67.41,85.14 v67.31,85.09 | v64.77,77.47 v64.77,80.01 64.77,80.06 62.33,80.06 | v64.77,82.55 v64.77,85.09 64.77,85.14 | v62.23,85.09 62.33,84.94 62.33,82.7 v62.23,82.55 62.33,82.5 62.33,80.06 | 64.77,85.14 62.33,85.14 v62.23,85.09 | 62.33,80.06 v62.23,80.01 62.33,79.86 62.33,77.62 v62.23,77.47 62.33,77.42 62.33,74.98 | 64.77,85.14 67.21,85.14 v67.31,85.09 | v86.36,96.52 v88.9,96.52 88.95,96.52 88.95,98.96 v88.9,99.06 88.75,99.16 86.51,99.16 v86.36,99.06 86.31,99.16 83.87,99.16 v83.82,99.06 | v78.74,96.52 78.79,96.52 78.79,98.96 v78.74,99.06 78.79,99.16 81.23,99.16 v81.28,99.06 81.43,99.16 83.67,99.16 v83.82,99.06 | v81.28,96.52 v83.82,96.52 83.87,96.52 | 83.87,96.52 83.87,98.96 v83.82,99.06 | v91.44,91.44 v93.98,91.44 96.47,91.44 | v91.44,86.36 v93.98,86.36 96.47,86.36 | 96.47,89 94.03,89 v93.98,88.9 93.83,89 91.59,89 v91.44,88.9 91.39,89 88.95,89 | 96.47,86.36 96.47,88.8 v96.52,88.9 96.47,89 | 96.47,86.36 v96.52,86.36 | 96.47,89 96.47,91.44 | 96.47,91.44 v96.52,91.44 | v81.28,93.98 81.43,94.08 83.67,94.08 v83.82,93.98 | 83.87,91.44 83.87,93.88 v83.82,93.98 | v86.36,88.9 86.51,89 88.75,89 v88.9,88.9 | v86.36,93.98 86.51,94.08 88.75,94.08 v88.9,93.98 88.95,93.88 88.95,91.44 | 88.95,91.44 88.95,89 | 88.95,91.44 v88.9,91.44 v86.36,91.44 83.87,91.44 | 83.87,91.44 v83.82,91.44 | 88.95,89 v88.9,88.9 | 83.87,96.52 83.87,94.08 v83.82,93.98 | v59.69,69.85 v59.69,72.39 v59.69,74.93 59.69,74.98 57.25,74.98 | v57.15,72.39 57.25,72.54 57.25,74.78 v57.15,74.93 57.25,74.98 | v59.69,77.47 v59.69,80.01 59.69,80.06 57.25,80.06
  Top 0.152: 57.25,74.98 57.25,77.42 v57.15,77.47 57.25,77.62 57.25,79.86 v57.15,80.01 57.25,80.06 | v59.69,82.55 v59.69,85.09 59.69,85.14 | v57.15,85.09 57.25,84.94 57.25,82.7 v57.15,82.55 57.25,82.5 57.25,80.06 | 59.69,85.14 57.25,85.14 v57.15,85.09 | v54.61,74.93 v54.61,77.47 v54.61,80.01 54.61,80.06 52.17,80.06 | v52.07,77.47 52.17,77.62 52.17,79.86 v52.07,80.01 52.17,80.06 | v54.61,82.55 v54.61,85.09 54.61,85.14 | v52.07,85.09 52.17,84.94 52.17,82.7 v52.07,82.55 52.17,82.5 52.17,80.06 | 54.61,85.14 52.17,85.14 v52.07,85.09 | 54.61,85.14 57.05,85.14 v57.15,85.09 | v44.45,52.07 v44.45,54.61 44.45,54.66 42.01,54.66 | v41.91,52.07 42.01,52.22 42.01,54.46 v41.91,54.61 42.01,54.66 | v44.45,57.15 v44.45,59.69 44.45,59.74 42.01,59.74 | 42.01,54.66 42.01,57.1 v41.91,57.15 42.01,57.3 42.01,59.54 v41.91,59.69 42.01,59.74 | v44.45,62.23 v44.45,64.77 44.45,64.82 42.01,64.82 | v44.45,67.31 v44.45,69.85 44.45,69.9 | 42.01,69.9 44.45,69.9 | 42.01,64.82 42.01,67.26 v41.91,67.31 42.01,67.46 42.01,69.7 v41.91,69.85 42.01,69.9 | 42.01,64.82 v41.91,64.77 42.01,64.62 42.01,62.38 v41.91,62.23 42.01,62.18 42.01,59.74 | v85.09,52.07 v85.09,54.61 85.09,54.66 82.65,54.66 v82.55,54.61 82.65,54.46 82.65,52.22 v82.55,52.07 82.65,52.02 82.65,49.58 | 82.65,49.58 85.09,49.58 | 82.65,49.58 v82.55,49.53 | v90.17,52.07 v90.17,54.61 90.17,54.66 87.73,54.66 v87.63,54.61 87.73,54.46 87.73,52.22 v87.63,52.07 87.73,52.02 87.73,49.58 | 87.73,49.58 90.17,49.58 | 87.73,49.58 v87.63,49.53 87.53,49.58 85.09,49.58 | 85.09,49.58 v85.09,49.53 | 44.45,77.42 42.01,77.42 v41.91,77.47 | v44.45,72.39 v44.45,74.93 44.45,74.98
  Top 0.152: v41.91,74.93 42.01,74.78 42.01,72.54 v41.91,72.39 42.01,72.34 42.01,69.9 | 44.45,74.98 42.01,74.98 v41.91,74.93 | 44.45,74.98 44.45,77.42 | 44.45,77.42 v44.45,77.47 | 92.81,52.02 92.81,49.58 | 92.81,49.58 95.25,49.58 | 92.81,49.58 v92.71,49.53 92.61,49.58 90.17,49.58 | 92.81,52.02 95.25,52.02 v95.25,52.07 | 92.81,52.02 v92.71,52.07 92.81,52.22 92.81,54.46 v92.71,54.61 92.81,54.66 92.81,55.07 93.83,56.08 | 95.25,49.58 97.69,49.58 v97.79,49.53 | 95.25,49.58 v95.25,49.53 | v49.53,80.01 v49.53,82.55 v49.53,85.09 49.53,85.14 | v46.99,82.55 47.09,82.7 47.09,84.94 v46.99,85.09 | v39.37,72.39 v39.37,74.93 39.37,74.98 | v39.37,67.31 v39.37,69.85 39.37,69.9 36.93,69.9 v36.83,69.85 36.73,69.7 36.12,69.09 | v39.37,62.23 v39.37,64.77 39.37,64.82 36.93,64.82 v36.83,64.77 36.73,64.82 34.29,64.82 | v39.37,57.15 v39.37,59.69 39.37,59.74 36.93,59.74 v36.83,59.69 36.73,59.74 35.92,59.74 35.71,59.74 | v39.37,52.07 v39.37,54.61 39.37,54.66 36.93,54.66 v36.83,54.61 36.73,54.66 35.71,54.66 | v36.83,52.07 36.73,52.02 35.92,52.02 35.71,52.01 | 35.71,57.51 36.32,57.51 36.52,57.3 36.73,57.3 v36.83,57.15 | v36.83,62.23 36.73,62.18 35.92,61.37 35.71,61.32 | 34.49,69.09 36.12,69.09 | 36.12,69.09 36.32,69.09 36.73,68.68 36.73,67.46 v36.83,67.31 | 34.49,69.09 C31.2 | 35.71,73.56 36.73,72.54 v36.83,72.39 | 35.71,74.98 36.73,74.98 v36.83,74.93 36.93,74.98 39.37,74.98 | 35.71,77.42 36.73,77.42 v36.83,77.47 36.93,77.42 39.37,77.42 v39.37,77.47 | 84.85,84.9 86.31,86.36 v86.36,86.36 v88.9,86.36 88.95,86.36 88.95,88.8 v88.9,88.9 | 77.23,92.52 78.59,93.88 v78.74,93.98 | 93.83,56.08 94.03,56.29 95.66,56.29 C41.2
  Top 0.152: 93.83,56.08 92.81,57.1 v92.71,57.15 | 93.73,59.74 92.81,59.74 v92.71,59.69 | 93.73,62.18 92.81,62.18 v92.71,62.23 | 93.73,64.82 92.81,64.82 v92.71,64.77 | 93.73,67.26 92.81,67.26 v92.71,67.31 | v92.71,69.85 92.81,69.9 93.62,69.9 93.73,69.8 | 45.27,86.76 46.89,85.14 v46.99,85.09 | 49.53,85.14 47.09,85.14 v46.99,85.09 | 39.37,74.98 41.81,74.98 v41.91,74.93 | 90.17,49.58 v90.17,49.53 | 49.53,85.14 51.97,85.14 v52.07,85.09 | 59.69,85.14 62.13,85.14 v62.23,85.09 | 69.85,85.14 72.29,85.14 v72.39,85.09 | 16.61,39.83 16.61,29.26 | 16.61,29.26 v16.51,29.21 | 44.45,69.9 46.89,69.9 v46.99,69.85 | v99.06,91.44 99.11,91.44 99.11,93.88 v99.06,93.98 98.91,94.08 96.67,94.08 v96.52,93.98 96.47,94.08 94.03,94.08 | v91.44,93.98 91.59,94.08 93.83,94.08 v93.98,93.98 94.03,94.08 | v91.44,96.52 v93.98,96.52 94.03,96.52 | v91.44,99.06 91.59,99.16 93.83,99.16 v93.98,99.06 | 94.03,96.52 94.03,98.96 v93.98,99.06 | 94.03,96.52 94.03,94.08 | v96.52,96.52 v99.06,96.52 99.11,96.52 99.11,98.96 v99.06,99.06 | v99.06,99.06 98.91,99.16 96.67,99.16 v96.52,99.06 96.47,99.16 94.03,99.16 v93.98,99.06 | v99.06,99.06 99.11,99.16 101.55,99.16 v101.6,99.06 101.55,98.96 101.55,96.52 v101.6,96.52 v104.14,96.52 104.19,96.52 104.19,94.08 | v101.6,91.44 v104.14,91.44 104.19,91.44 104.19,93.88 v104.14,93.98 | v101.6,93.98 101.75,94.08 103.99,94.08 v104.14,93.98 | 104.19,94.08 106.63,94.08 v106.68,93.98 112.06,88.6 112.06,63.1 112.63,62.53 112.83,62.53 114,61.36 114,37.61 109.4,33.01 109.4,25.68 103.81,20.09 103.81,19.28 104.37,18.72 105.18,18.72 110.57,24.11 110.57,32.52 118.95,40.91 118.95,86.6 111.79,93.76 111.79,95.26
  Top 0.152: 104.19,94.08 v104.14,93.98
  Top 0.254: IC4.3 13.73,102.78 C24.2
  Top 0.508: 80.64,5.08 IC1.9 78.74,10.59 C3.2 79.79,11.64 C1.2 86.36,9.1 86.36,5.84 88.14,4.06 89.99,4.06 R20.1 R4.1 95.43,4.06 100.95,4.06 102.87,5.99 IC2.9 | 80.64,5.08 IC1.5 | C54.2 C55.2 25.41,91.03 25.41,85.84 26.67,84.58 SOCKET.P$6 30.91,83.82 C23.2 C22.2 35.71,84.03 42.54,84.03 45.27,86.76 C49.2 | RS_UART.1 41.27,3.18 44.88,3.18 R14.1 R7.1 55.24,8.69 GND.1 GND.2 GND.3 60.32,7.49 63.52,4.3 66.1,4.3 R10.1 R2.1 71.3,4.06 79.63,4.06 80.64,5.08 | IC2.5 104.78,5.08 IC2.9 | IC2.9 102.87,10.59 C6.2 103.92,11.64 C4.2 | C48.2 C49.2 | C49.2 54.79,91.69 56.13,91.69 | 56.13,91.69 57.58,93.14 C15.2 C14.2 | 56.13,91.69 64.01,91.69 | 64.01,91.69 65.61,93.3 C50.2 C51.2 | 64.01,91.69 68.4,91.69 | 68.4,91.69 C16.2 C17.2 | 68.4,91.69 73.48,91.69 C52.2 | C52.2 C53.2 75.77,100.66 76.19,101.08 76.19,102.86 SOCKET.P$133 | C52.2 77.23,92.52 84.85,84.9 88.68,81.08 | 88.68,81.08 C44.2 C45.2 100.53,82.55 104.14,82.55 SOCKET.P$113 | 88.68,81.08 93.76,76 C46.2 C47.2 | C47.2 100.12,74.93 104.14,74.93 SOCKET.P$109 | C20.2 C47.2 | C20.2 C21.2 93.73,69.8 93.73,67.26 93.73,64.82 93.73,62.18 93.73,61.14 | C20.2 101.93,71.96 102.35,72.38 103.62,72.38 103.63,72.39 104.14,72.39 SOCKET.P$105 | SOCKET.P$99 104.14,62.23 103.12,62.23 103.11,62.24 102.35,62.24 101.3,63.3 C38.2 C39.2 93.73,61.14 | SOCKET.P$93 104.14,57.15 102.87,57.15 102.86,57.14 102.35,57.14 101.52,56.31 C40.2 C41.2 93.73,58.47 93.73,59.74 93.73,61.14 | SOCKET.P$83 104.15,41.92 102.35,41.92 101.3,42.98 C42.2 C43.2 | ALL_JTAG.4 ALL_JTAG.6 ALL_JTAG.8 ALL_JTAG.10 | J1.3 J1.2 J1.1 | J1.1 J1.4 | S4.3 5.71,90.17 J1.1 | SOCKET.P$21 24.13,64.26 25.39,65.52 25.39,66.56 24.13,67.82 SOCKET.P$17 25.4,69.85 30.27,69.85 C30.2 C31.2 34.29,64.82 34.29,62.74 35.71,61.32 35.71,59.74
  Top 0.508: SOCKET.P$25 25.39,57.16 27.19,57.16 27.61,57.58 C29.2 C28.2 34.29,58.32 35.71,59.74 | 35.71,59.74 35.71,57.51 35.71,54.66 35.71,52.01 C26.2 C27.2 30.18,50.6 28.7,52.07 25.4,52.07 SOCKET.P$31 | C18.2 C19.2 | v91.44,96.52 88.95,96.52
  Bottom 0.152: SOCKET.P$58 63.55,29.26 59.28,29.26 58.06,28.04 57.25,28.04 SOCKET.P$51 57.05,27.84 57.05,23.57 53.59,20.12 53.59,19.71 52.58,18.69 52.17,18.69 50.95,17.48 50.95,14.43 55.22,10.16 GND.1 | 105.82,43.69 105.41,43.28 SOCKET.P$83 105.82,43.69 | 105.82,43.69 106.43,44.3 113.33,44.3 114.35,43.28 115.57,43.28 ALL_JTAG.18 | 102.97,50.8 102.97,51.82 104.19,53.04 104.19,54.66 SOCKET.P$93 | 105.82,43.69 103.99,45.52 103.99,49.78 102.97,50.8 | 102.97,50.8 SOCKET.P$90
  Bottom 0.508: 73.54,108.11 73.02,107.6 73.02,104.78 SOCKET.P$137 | BIAS.4 73.54,109.34 73.54,108.11 | 73.54,108.11 77.47,104.18 SOCKET.P$133
  pour Top (rank 2, no thermals): -7.62,125.73 132.08,125.73 132.08,5.08 132.08,-8.89 0,-8.89 -7.62,-8.89
  pour Bottom (rank 2, no thermals): -8.89,127 133.35,127 133.35,86.36 133.35,-10.16 -8.89,-10.16
IN_3.3
  Top 0.508: IC3.6 IC3.7 IC3.8 115.14,28.95 C7.1 115.27,31.24 120.4,31.24 121.41,30.23 121.41,12.45 118.87,9.91 114.05,9.91 107.95,3.81 | IC1.6 IC1.7 IC1.8 81.66,8.69 C1.1 83.82,5.08 80.77,2.03 | IC2.6 IC2.7 IC2.8 105.79,8.69 C4.1 107.95,3.81 | POWER_IN.1 62.1,2.03 80.77,2.03 | 80.77,2.03 106.17,2.03 107.95,3.81
  pour Top (no thermals): 58.22,4.17 60.81,1.57 106.98,1.57 107.31,1.91 106.73,2.49 62.38,2.49 59.87,5 59.87,6.22 59.64,6.45 58.57,6.45 58.22,6.1
  pour Top (no thermals): 80.67,9.14 80.67,6.02 80.72,5.97 82.22,5.97 82.78,5.97 83.08,5.66 83.08,5.26 83.08,4.95 80.57,2.44 81.81,2.44 83.69,4.32 84.28,4.9 84.28,6.43 84.28,7.42 84.89,8.03 84.89,9.3 84.73,9.45 84.68,9.5 81.15,9.5 80.85,9.5 80.67,9.32
  pour Top (no thermals): 104.75,9.19 104.75,6.02 104.83,5.94 104.85,5.92 106.3,5.92 107.21,5 107.21,4.32 107.21,3.84 105.54,2.16 105.54,2.03 105.66,1.91 107.29,1.91 108.36,2.97 108.36,7.21 108.36,7.42 108.92,7.98 108.99,8.05 108.99,9.27 108.86,9.4 106.43,9.4 104.88,9.4 104.75,9.27
  pour Top (no thermals): 108.13,2.74 114.78,9.4 118.67,9.4 119.13,9.4 121.64,11.91 121.87,12.14 121.87,13.18 121.87,30.38 120.73,31.52 120.09,30.89 120.09,30.63 120.98,29.74 120.98,28.19 120.98,12.67 118.69,10.39 114.12,10.39 108.13,4.39
  pour Top (no thermals): 120.07,30.61 116.36,30.61 115.85,30.1 115.85,29.87 115.93,29.79 116.05,29.67 117.63,29.67 119.1,29.67 119.28,29.49 119.28,27.99 119.15,27.86 119.1,27.81 114.66,27.81 114.43,28.04 114.43,29.67 114.43,32.03 114.6,32.21 115.72,32.21 115.85,32.08 115.93,32 115.93,31.67 116.08,31.52 120.73,31.52 120.73,31.24 120.09,30.61
N$1
  Top 0.508: C2.2 R1.2 73.86,7.21 73.86,6.35 | 73.86,6.35 R2.2 | IC1.3 73.86,6.35
  pour Top (no thermals): 68.22,8.15 68.38,8 69.93,8 71.32,8 71.58,7.75 71.86,7.47 71.86,5.66 71.86,4.78 72.09,4.55 73.13,4.55 73.28,4.7 73.33,4.75 73.33,5.64 73.56,5.87 76.02,5.87 76.83,5.87 76.96,5.99 76.96,6.65 76.83,6.78 74.47,6.78 74.42,6.83 74.42,7.26 73.58,8.1 73.58,9.22 73.28,9.53 68.45,9.53 68.17,9.25 68.15,9.22 68.15,8.33 68.15,8.23
N$2
  Top 0.508: 96.72,6.48 96.72,8.48 R3.2 C5.2 | 96.72,6.48 R4.2 | IC2.3 96.85,6.35 96.72,6.48
  pour Top (no thermals): 92.46,8.18 95.4,8.18 95.86,7.72 95.86,5.16 96.27,4.75 97.33,4.75 97.41,4.83 97.41,5.92 97.43,5.94 100.89,5.94 101.12,6.17 101.12,6.55 100.97,6.71 97.79,6.71 97.59,6.91 97.59,9.32 97.36,9.55 92.61,9.55 92.28,9.22 92.28,8.36
N$3
  Top 0.508: C8.2 R5.2 115.35,19.89 117.35,19.89 | 117.35,19.89 R6.2 | IC3.3 117.47,20.02 117.35,19.89
  pour Top (no thermals): 115.6,15.47 115.85,15.72 115.85,18.54 116.48,19.18 118.95,19.18 119.13,19.35 119.13,20.35 119.13,20.47 119,20.6 118.97,20.62 117.88,20.62 117.88,24.08 117.81,24.16 117.14,24.16 117.04,24.05 117.04,23.34 117.04,20.98 116.92,20.85 116.84,20.78 115.06,20.78 114.63,20.78 114.4,20.55 114.4,15.62 114.6,15.42 115.54,15.42
N$4
  Top 0.508: R7.2 LW_O1.C
N$6
  Top 0.152: 45.06,5.99 R14.2
  Top 0.508: LW_O0.C 45.08,6.02 45.06,5.99
N$7
  Top 0.254: IC4.2 15.24,104.53 C24.1
  Top 0.508: Y2.2 15.26,106.17 | 15.26,106.17 15.26,105 C24.1 | R8.1 11.99,106.17 15.26,106.17
  pour Top (no thermals): 15.37,101.75 15.37,103.23 16.13,103.99 16.13,105.56 15.67,106.02 15.67,107.47 15.87,107.67 15.87,109.52 15.77,109.63 14.76,109.63 14.63,109.5 14.63,106.98 14.25,106.6 11.68,106.6 9.68,104.6 8.76,104.6 8.61,104.44 8.61,102.59 8.74,102.46 9.91,102.46 9.98,102.54 9.98,103.63 11.91,105.82 14.66,105.82 14.81,105.66 14.81,103.53 15.11,103.23 15.11,101.65 15.19,101.57
N$8
  Top 0.254: IC4.4 12.58,100.02 12.36,100.24 12.36,97.76 12.9,97.22 13.59,97.22 IC5.2
  Top 0.508: R8.2 R11.2 12.36,100.24
  pour Top (no thermals): 11.73,104.39 11.66,104.32 11.66,99.85 11.66,98.35 13,97 14.22,97 14.22,97.31 13.06,97.31 12.67,97.69 12.67,98.15 12.67,99.06 13,99.39 13.39,99.77 14.43,99.77 14.63,99.77 14.73,99.87 14.73,100.15 14.68,100.2 13.97,100.2 13.44,100.2 12.93,100.71 12.93,101.32 12.93,104.32 12.85,104.39
N$9
  Top 0.508: LED3.C 64.56,7.64 R10.2
N$10
  Top 0.508: LED4.C 88.69,7.64 R20.2
N$11
  Top 0.508: R18.2 116.19,11.86 LED5.C
N$13
  Top 0.508: R11.1 7.87,101.78 7.87,104.27 13.84,110.24 16.11,110.24 Y2.1 17.78,108.56 C25.1
OUT_0.8
  Top 0.508: IC1.2 IC1.1 76.63,9.49 C3.1 | C3.1 72.59,11.43 R1.1 C2.1 66.46,11.64 LED3.A | C3.1 79.17,13.97 93.98,13.97 CHIP.8
  pour Top (no thermals): 65.23,10.97 65.35,10.85 73.91,10.85 74.8,9.96 74.8,7.59 75.18,7.21 76.83,7.21 77.01,7.39 77.01,10.11 77.72,10.82 77.72,12.07 77.17,12.62 65.61,12.62 65.23,12.24
  pour Top (no thermals): 76.15,12.6 78.13,14.58 93.75,14.58 96.95,17.78 97.46,17.78 97.84,17.4 97.84,16.99 94.46,13.61 79.4,13.61 77.75,11.96 76.73,11.96 76.15,12.55
OUT_1.2
  Top 0.508: 100.46,11.43 C6.1 100.76,16.08 CHIP.6 | 100.46,11.43 96.72,11.43 R3.1 C5.1 90.59,11.64 LED4.A | IC2.2 IC2.1 100.16,11.13 100.46,11.43
  Bottom 0.508: CHIP.6 100.36,16.48 100.36,15.11 100.74,14.73 | 100.74,14.73 105.25,14.73 119.38,28.86 119.38,65.41 | 119.38,65.41 119.38,67.95 | 119.38,67.95 119.38,70.49 | 119.38,70.49 119.38,73.03 | 119.38,73.03 119.38,75.57 | 119.38,75.57 119.38,85.34 90.42,114.3 72.39,114.3 | 14.1,73.53 18.8,78.23 18.8,88.39 44.7,114.3 62.86,114.3 | 14.1,73.53 13.72,73.15 13.72,71.37 | 13.72,71.37 13.72,68.83 BOTTOM_VDD.2 | 72.39,114.3 67.94,114.3 | 67.94,114.3 65.41,114.3 | 65.41,114.3 62.86,114.3 | BOTTOM_VDD.4 13.72,71.37 | BOTTOM_VDD.6 14.1,73.53 | LEFT_VDD.2 62.86,114.3 | LEFT_VDD.4 65.41,114.3 | LEFT_VDD.6 67.94,114.3 | TOP_VDD.10 119.38,65.41 | TOP_VDD.8 119.38,67.95 | TOP_VDD.6 119.38,70.49 | TOP_VDD.4 119.38,73.03 | TOP_VDD.2 119.38,75.57 | RIGHT_VDD.6 54.49,14.73 57.03,14.73 | 57.03,14.73 59.57,14.73 | 59.57,14.73 100.74,14.73 | RIGHT_VDD.2 59.57,14.73 | BIAS.2 72.39,114.3 | RIGHT_VDD.4 57.03,14.73
  pour Top (no thermals): 89.28,12.01 89.28,11 89.43,10.85 98.6,10.85 99.21,10.24 99.21,7.29 99.36,7.14 100.91,7.14 101.19,7.42 101.19,10.03 101.27,10.11 101.27,16.46 100,17.73 99.44,17.73 99.09,17.37 99.09,16.94 100.25,15.77 100.25,12.9 99.82,12.47 89.74,12.47
  pour Bottom (no thermals): 105.59,14.35 54.58,14.35 54.13,14.81 54.13,15.11 54.25,15.24 105.13,15.24 106.5,16.61 106.5,15.27
  pour Bottom (no thermals): 106.48,16.59 119,29.11 119,39.83 119,85.17 90.27,113.89 44.88,113.89 42.52,111.53 19.35,88.37 19.35,80.14 19.35,78.16 16.48,75.29 14.17,72.97 14.17,68.55 13.72,68.55 13.61,68.66 13.26,69.01 13.26,70.66 13.26,73.36 18.26,78.36 18.26,88.49 18.8,89.03 44.58,114.81 56.36,114.81 91.16,114.81 119.35,86.61 120.04,85.93 120.04,82.04 120.04,28.78 106.15,14.88 106.15,16.26
OUT_3.3
  Top 0.508: IC3.2 IC3.1 113,23.32 | 113,23.32 C9.1 | 113,23.32 112.19,22.52 R5.1 C8.1 | C8.1 111.55,17.15 CHIP.2 CHIP.4 | C8.1 112.19,13.76 LED5.A
  pour Top (no thermals): 112.83,12.62 112.83,21.31 113.72,22.2 116.41,22.2 116.64,22.43 116.64,24.18 116.56,24.26 113.94,24.26 113.56,24.64 111.43,24.64 111.33,24.54 111.33,13.07 111.78,12.62
  pour Top (no thermals): 101.65,16.76 101.98,16.43 111.63,16.43 111.63,17.73 101.98,17.73 101.65,17.4
RS_ASCON_VDD
  Top 0.508: C26.1 C27.1 28.75,53.55 27.7,54.6 25.39,54.6 SOCKET.P$29 17.78,59.69 BOTTOM_VDD.1
RS_CHACHA20_VDD
  Top 0.508: C28.1 C29.1 30.29,59.7 25.39,59.7 SOCKET.P$23 21.59,63.5 21.59,66.04 BOTTOM_VDD.3
RS_ELEPHANT_VDD
  Top 0.508: SOCKET.P$49 53.34,29.21 53.34,33.23 C37.1 C36.1
  Bottom 0.508: RIGHT_VDD.5 54.61,22.23 SOCKET.P$49
RS_FROPUF_VDD
  Top 0.508: LEFT_VDD.1 57.15,106.05 SOCKET.P$149 55.88,102.87 55.88,97.59 C48.1 C49.1
RS_GIFT_COFB_VDD
  Top 0.508: SOCKET.P$60 67.31,34.09 C34.1 C35.1
  Bottom 0.508: SOCKET.P$60 66.04,29.21 66.04,26.92 64.52,25.4 60.32,25.4 RIGHT_VDD.3
RS_GRAIN_128AEAD_VDD
  Top 0.508: C33.1 C32.1 72.59,30.69 SOCKET.P$64
  Bottom 0.508: SOCKET.P$64 71.12,29.21 71.12,26.92 67.56,23.37 60.83,23.37 RIGHT_VDD.1
RS_ISAP_VDD
  Top 0.508: 101.35,47.24 101.35,54.1 101.85,54.61 106.04,54.61 110.49,59.06 TOP_VDD.9 | 101.35,47.24 SOCKET.P$86 | 101.35,47.24 100.03,45.93 C42.1 C43.1
RS_LW_SOC_CLK
  Top 0.508: RS_CLK.2 22.22,76.2 SOCKET.P$11
RS_LW_SOC_DEBUGM_RST
  Bottom 0.508: ALL_JTAG.3 108.2,60.96 106.93,62.23 104.14,62.23 SOCKET.P$98
RS_LW_SOC_DEBUGM_TCK
  Top 0.508: SOCKET.P$87 110.49,53.34 ALL_JTAG.9
RS_LW_SOC_DEBUGM_TDI
  Bottom 0.508: ALL_JTAG.5 107.95,53.34 SOCKET.P$91
RS_LW_SOC_DEBUGM_TDO
  Bottom 0.508: SOCKET.P$95 106.68,59.69 113.38,59.69 114.3,58.77 114.3,49.53 ALL_JTAG.13
RS_LW_SOC_DEBUGM_TMS
  Bottom 0.508: ALL_JTAG.7 107.7,50.55 107.7,47.75 105.66,45.72 SOCKET.P$85
RS_LW_SOC_I0
  Bottom 0.508: GPIO_IN.8 16.51,48.26 SOCKET.P$27
RS_LW_SOC_I1
  Bottom 0.508: GPIO_IN.7 16.76,45.72 23.11,52.07 25.4,52.07 SOCKET.P$30
RS_LW_SOC_I2
  Bottom 0.508: GPIO_IN.6 17.27,43.18 23.62,49.53 25.4,49.53 SOCKET.P$32
RS_LW_SOC_I3  (via drill 0.35)
  Top 0.508: SOCKET.P$34 25.41,47 23.38,47 17.02,40.64 v15.24,40.64
  Bottom 0.508: v15.24,40.64 GPIO_IN.5
RS_LW_SOC_I4
  Bottom 0.508: GPIO_IN.4 19.05,38.1 SOCKET.P$37
RS_LW_SOC_I5
  Bottom 0.508: GPIO_IN.3 19.05,35.56 SOCKET.P$39
RS_LW_SOC_I6
  Bottom 0.508: GPIO_IN.2 49.53,33.02 SOCKET.P$48
RS_LW_SOC_I7
  Bottom 0.508: GPIO_IN.1 41.91,30.48 43.18,29.21 53.34,29.21 SOCKET.P$50
RS_LW_SOC_I8
  Top 0.508: RS_UART.2 43.43,12.95 43.43,16.51 52.07,25.15 56.9,25.15 SOCKET.P$53
RS_LW_SOC_O0
  Top 0.508: SOCKET.P$57 GPIO_OUT.8 60.96,15.24 49.68,15.24 45.08,10.64 LW_O0.A
RS_LW_SOC_O1
  Top 0.508: SOCKET.P$59 GPIO_OUT.7 60.8,12.55 51.46,12.55 49.53,10.62 LW_O1.A
RS_LW_SOC_O2
  Top 0.508: GPIO_OUT.6 SOCKET.P$61
RS_LW_SOC_O3
  Top 0.508: GPIO_OUT.5 SOCKET.P$63
RS_LW_SOC_O4
  Top 0.508: GPIO_OUT.4 SOCKET.P$65
RS_LW_SOC_O5
  Top 0.508: GPIO_OUT.3 SOCKET.P$67
RS_LW_SOC_O6
  Bottom 0.508: GPIO_OUT.2 80.01,26.04 81.28,27.31 81.28,29.21 SOCKET.P$70
RS_LW_SOC_O7
  Bottom 0.508: SOCKET.P$72 83.82,29.21 83.82,27.31 82.55,26.04 GPIO_OUT.1
RS_LW_SOC_O8  (via drill 0.35)
  Top 0.508: RS_UART.4 38.73,31.88 52.07,45.21 v52.32,45.21 | SOCKET.P$81 102.36,37.59 84.58,37.59 76.96,45.21 v67.82,45.21
  Bottom 0.508: v67.82,45.21 v52.32,45.21
RS_LW_SOC_QSPI_CLK
  Bottom 0.508: RS_FLASH.6 16.76,59.69 21.84,64.77 25.4,64.77 SOCKET.P$20
RS_LW_SOC_QSPI_MISO  (via drill 0.35)
  Top 0.508: RS_FLASH.8 10.92,54.48 v10.92,53.24
  Bottom 0.152: v10.92,53.24 10.92,53.09
  Bottom 0.508: 10.92,53.09 16.26,53.09 22.86,59.69 25.4,59.69 SOCKET.P$24
RS_LW_SOC_QSPI_MOSI
  Bottom 0.508: SOCKET.P$22 25.4,62.23 22.35,62.23 14.73,54.61 RS_FLASH.10
RS_LW_SOC_QSPI_SS
  Bottom 0.508: RS_FLASH.12 7.11,53.22 7.11,60.2 7.87,60.96 13.72,60.96 22.61,69.85 25.4,69.85 SOCKET.P$18
RS_LW_SOC_RST
  Top 0.508: RS_RST.1 12.06,71.12 SOCKET.P$15
RS_LW_SOC_VDD
  Top 0.508: C31.1 C30.1 27.61,71.96 27.19,72.38 25.41,72.38 SOCKET.P$13 19.05,73.66 BOTTOM_VDD.5
RS_PHOTON_BEETLE_VDD
  Top 0.508: C41.1 C40.1 99.49,59.69 104.14,59.69 SOCKET.P$97 108.71,64.26 108.71,72.52 TOP_VDD.7
RS_ROMULUS_VDD
  Top 0.508: C39.1 C38.1 100.53,64.77 102.36,64.77 102.37,64.78 103.39,64.78 104.65,66.04 SOCKET.P$101 107.19,67.82 107.19,73.53 TOP_VDD.5
RS_SPARKLE_VDD
  Top 0.508: C46.1 C47.1 100.1,79.98 100.18,79.98 100.19,80 104.15,80 SOCKET.P$111 106.04,79.38 TOP_VDD.3
RS_TINYJAMBU_VDD
  Top 0.508: C44.1 C45.1 100.12,85.09 104.14,85.09 SOCKET.P$115 107.31,81.92 TOP_VDD.1
RS_TRNG_VDD
  Top 0.508: C50.1 C51.1 62.66,98.98 63.5,99.82 63.5,102.87 SOCKET.P$143 64.77,106.05 LEFT_VDD.3
RS_VBN
  Top 0.508: SOCKET.P$141 66.04,102.87 66.04,100.08 67.74,98.38 C17.1 C16.1
  Bottom 0.508: BIAS.3 SOCKET.P$141
RS_VBP
  Top 0.508: SOCKET.P$145 60.96,102.87 60.96,97.59 C14.1 C15.1
  Bottom 0.508: BIAS.1 67.82,108.59 65.91,106.68 64.77,106.68 SOCKET.P$145
RS_XOODYAK_VDD
  Top 0.508: C52.1 C53.1 72.82,98.63 71.12,100.33 71.12,102.87 SOCKET.P$139 69.22,104.14 LEFT_VDD.5
RST_SW3
  Top 0.508: R9.1 6.14,70.49 RS_RST.2
  Bottom 0.508: S4.2 13.21,85.22 13.21,74.8 RS_RST.2
SMA_CLK1
  Top 0.508: J1.5 RS_CLK.1
  pour Top (no thermals): 8.18,79.68 16.71,79.68 16.79,79.76 16.79,80.34 16.74,80.39 12.29,80.39 12.27,80.37 8.13,80.37 7.87,80.11 7.87,79.98
VCCQ
  Top 0.508: SOCKET.P$33 25.4,49.53 29.97,49.53 30,49.5 30.08,49.5 C18.1 C19.1 58.21,48.47 64.13,42.55 | 102.11,25.4 102.36,25.4 107.95,30.99 107.95,45.97 106.93,46.99 104.14,46.99 SOCKET.P$88 | CHIP.3 102.23,25.27 102.11,25.4 | 102.11,25.4 82.55,25.4 SOCKET.P$69 78.74,29.21 78.74,38.74 74.93,42.55 64.13,42.55 | SOCKET.P$55 60.96,29.21 60.96,39.37 64.13,42.55
  Bottom 0.508: SOCKET.P$19 25.4,67.31 28.96,67.31 | SOCKET.P$33 25.39,47 27.19,47 28.96,48.77 28.96,67.31 | 28.96,67.31 28.96,78.23 27.19,80 27.17,80.02 23.36,80.02 22.61,80.77 22.61,84.84 SOCKET.P$3
  pour Top (no thermals): 101.65,19.35 101.65,24.51 101.35,24.82 82.12,24.82 78.38,28.55 78.38,31.85 79.04,31.85 79.15,31.75 79.15,29.39 82.73,25.81 101.85,25.81 102.84,24.82 102.84,19.43 102.51,19.1 101.9,19.1
  pour Top (no thermals): 101.83,25.73 107.57,31.47 107.57,45.54 107.57,45.9 106.83,46.63 106.76,46.71 104.14,46.71 103.71,46.71 102.44,47.98 102.44,48.31 102.84,48.72 102.92,48.72 104.32,47.32 107.11,47.32 107.9,46.53 108.28,46.15 108.28,30.89 108.28,30.25 102.72,24.69 101.83,25.58
  pour Top (no thermals): 78.36,31.78 78.36,38.58 74.8,42.14 64.24,42.14 63.91,41.81 61.29,39.19 61.29,29.41 62.59,28.12 62.59,27.84 62.59,27.74 62.41,27.56 62.08,27.56 60.68,28.96 60.68,39.55 63.96,42.82 64.01,42.88 65.25,42.88 75.08,42.88 78.97,38.99 79.15,38.81 79.15,31.67 78.46,31.67
VDD_3.3V
  Top 0.254: C54.1 17.27,99.7 16.21,99.7 IC4.5 15.89,98.14 IC5.5
  Top 0.508: 3.56,66.93 RS_FLASH.1 RS_FLASH.2 | R9.2 3.56,71.71 | 3.56,66.93 3.56,71.71 | 3.56,71.71 3.56,94.36 S4.1 5.08,104.9 12.19,112.01 18.54,112.01 | 18.54,112.01 21.08,109.47 21.08,103.52 18.2,100.64 18.2,100.62 17.27,99.7 | CHIP.1 109.98,24.89 109.98,32.77 118.36,41.15 118.36,63.5 | 18.54,112.01 20.57,114.05 90.68,114.05 118.36,86.36 118.36,63.5 | 3.56,66.93 3.56,27.94 19.55,11.94 37.59,11.94 RS_UART.3 | ALL_JTAG.1 ALL_JTAG.2 118.36,63.5
  pour Top (no thermals): 104.11,19.86 109.5,25.25 109.5,32.99 117.7,41.2 118.75,41.2 118.77,41.17 118.77,40.97 110.52,32.72 110.52,24.51 105.05,19.05 104.47,19.05 104.11,19.41
  pour Top (no thermals): 117.73,41.22 117.73,86.13 90.53,113.33 90.53,114.05 90.91,114.43 118.77,86.56 118.77,41.1 117.86,41.1
  pour Top (no thermals): 117.7,62.81 112.83,62.81 112.42,63.22 112.42,63.73 112.78,64.08 117.78,64.08 117.88,63.98 117.88,62.97 117.73,62.81
  pour Top (no thermals): 90.58,113.28 20.5,113.28 19.23,112.01 19.02,112.01 18.44,112.6 20.27,114.43 90.91,114.43 90.91,113.61
  pour Top (no thermals): 18.41,112.6 18.11,112.29 16.94,112.29 11.96,112.29 4.78,105.11 4.44,104.78 4.44,96.11 3.2,94.87 3.2,93.27 3.2,27.51 19.15,11.56 32.46,11.56 36.91,11.56 37.77,10.69 38.23,10.24 39.22,10.24 39.37,10.39 39.5,10.52 39.5,11.18 38.38,12.29 36.65,12.29 19.71,12.29 17.75,14.25 4.11,27.89 4.11,37.26 4.11,94.03 5.59,95.5 5.74,95.66 5.74,97 5.74,104.9 12.4,111.56 18.75,111.56 19.25,112.06 18.72,112.6
  pour Top (no thermals): 18.44,111.56 20.7,109.3 20.7,103.84 17.37,100.51 17.37,100.33 17.63,100.08 18.14,100.08 21.51,103.45 21.51,105.54 21.51,109.6 19.1,112.01 18.9,112.01
VDD_5V_UART
  Top 0.508: USB-UART_4.2 38.02,1.35 52.78,1.35 POWER_IN.2
  pour Top (no thermals): 30.53,8.18 37.77,0.94 47.73,0.94 53.19,0.94 56.64,4.39 56.95,4.7 56.95,5.23 56.69,5.49 56.29,5.49 55.8,5 52.55,1.75 40.69,1.75 38.33,1.75 34.95,5.13 31.29,8.79 31.14,8.79 31.04,8.79 30.63,8.38 30.53,8.28
VDDH
  Top 0.508: SOCKET.P$103 104.13,67.3 100.77,67.3 C20.1 C21.1
  Bottom 0.508: SOCKET.P$103 104.14,67.31 101.6,67.31 99.69,65.41 CHIP.5
VDDLS
  Top 0.508: C22.1 C23.1 30.91,81.28 SOCKET.P$8
  Bottom 0.508: CHIP.7 97.16,29.21 45.08,81.28 SOCKET.P$8

## Text on the board
tNames: XOODYAK | PROPUF | TRNG | VBP | VBN | CLOCK / QSPI | SOTB LWC Jan. 2023 / OLINGUITO Crypto Core / Copyright © UEC PHAM LAB 2023 | CRYSTAL | TINY | SMA | SPARKLE | ROMULUS | VDD | BEETLE | ISAP | CHACHA | ASCON | CLK | MISO | MOSI | SS | 0 | 7 | ELEPHANT | GRAIN_128 | GILF | 0 | 7 | VDDLS | VDDH | VCCQ | 3.3V | 5V | top | UART + LED | POWER
bNames: bottom